# Altium schematic sheet Reflectance.SchDoc
size A3; SheetNumber: 3; SheetTotal: 9
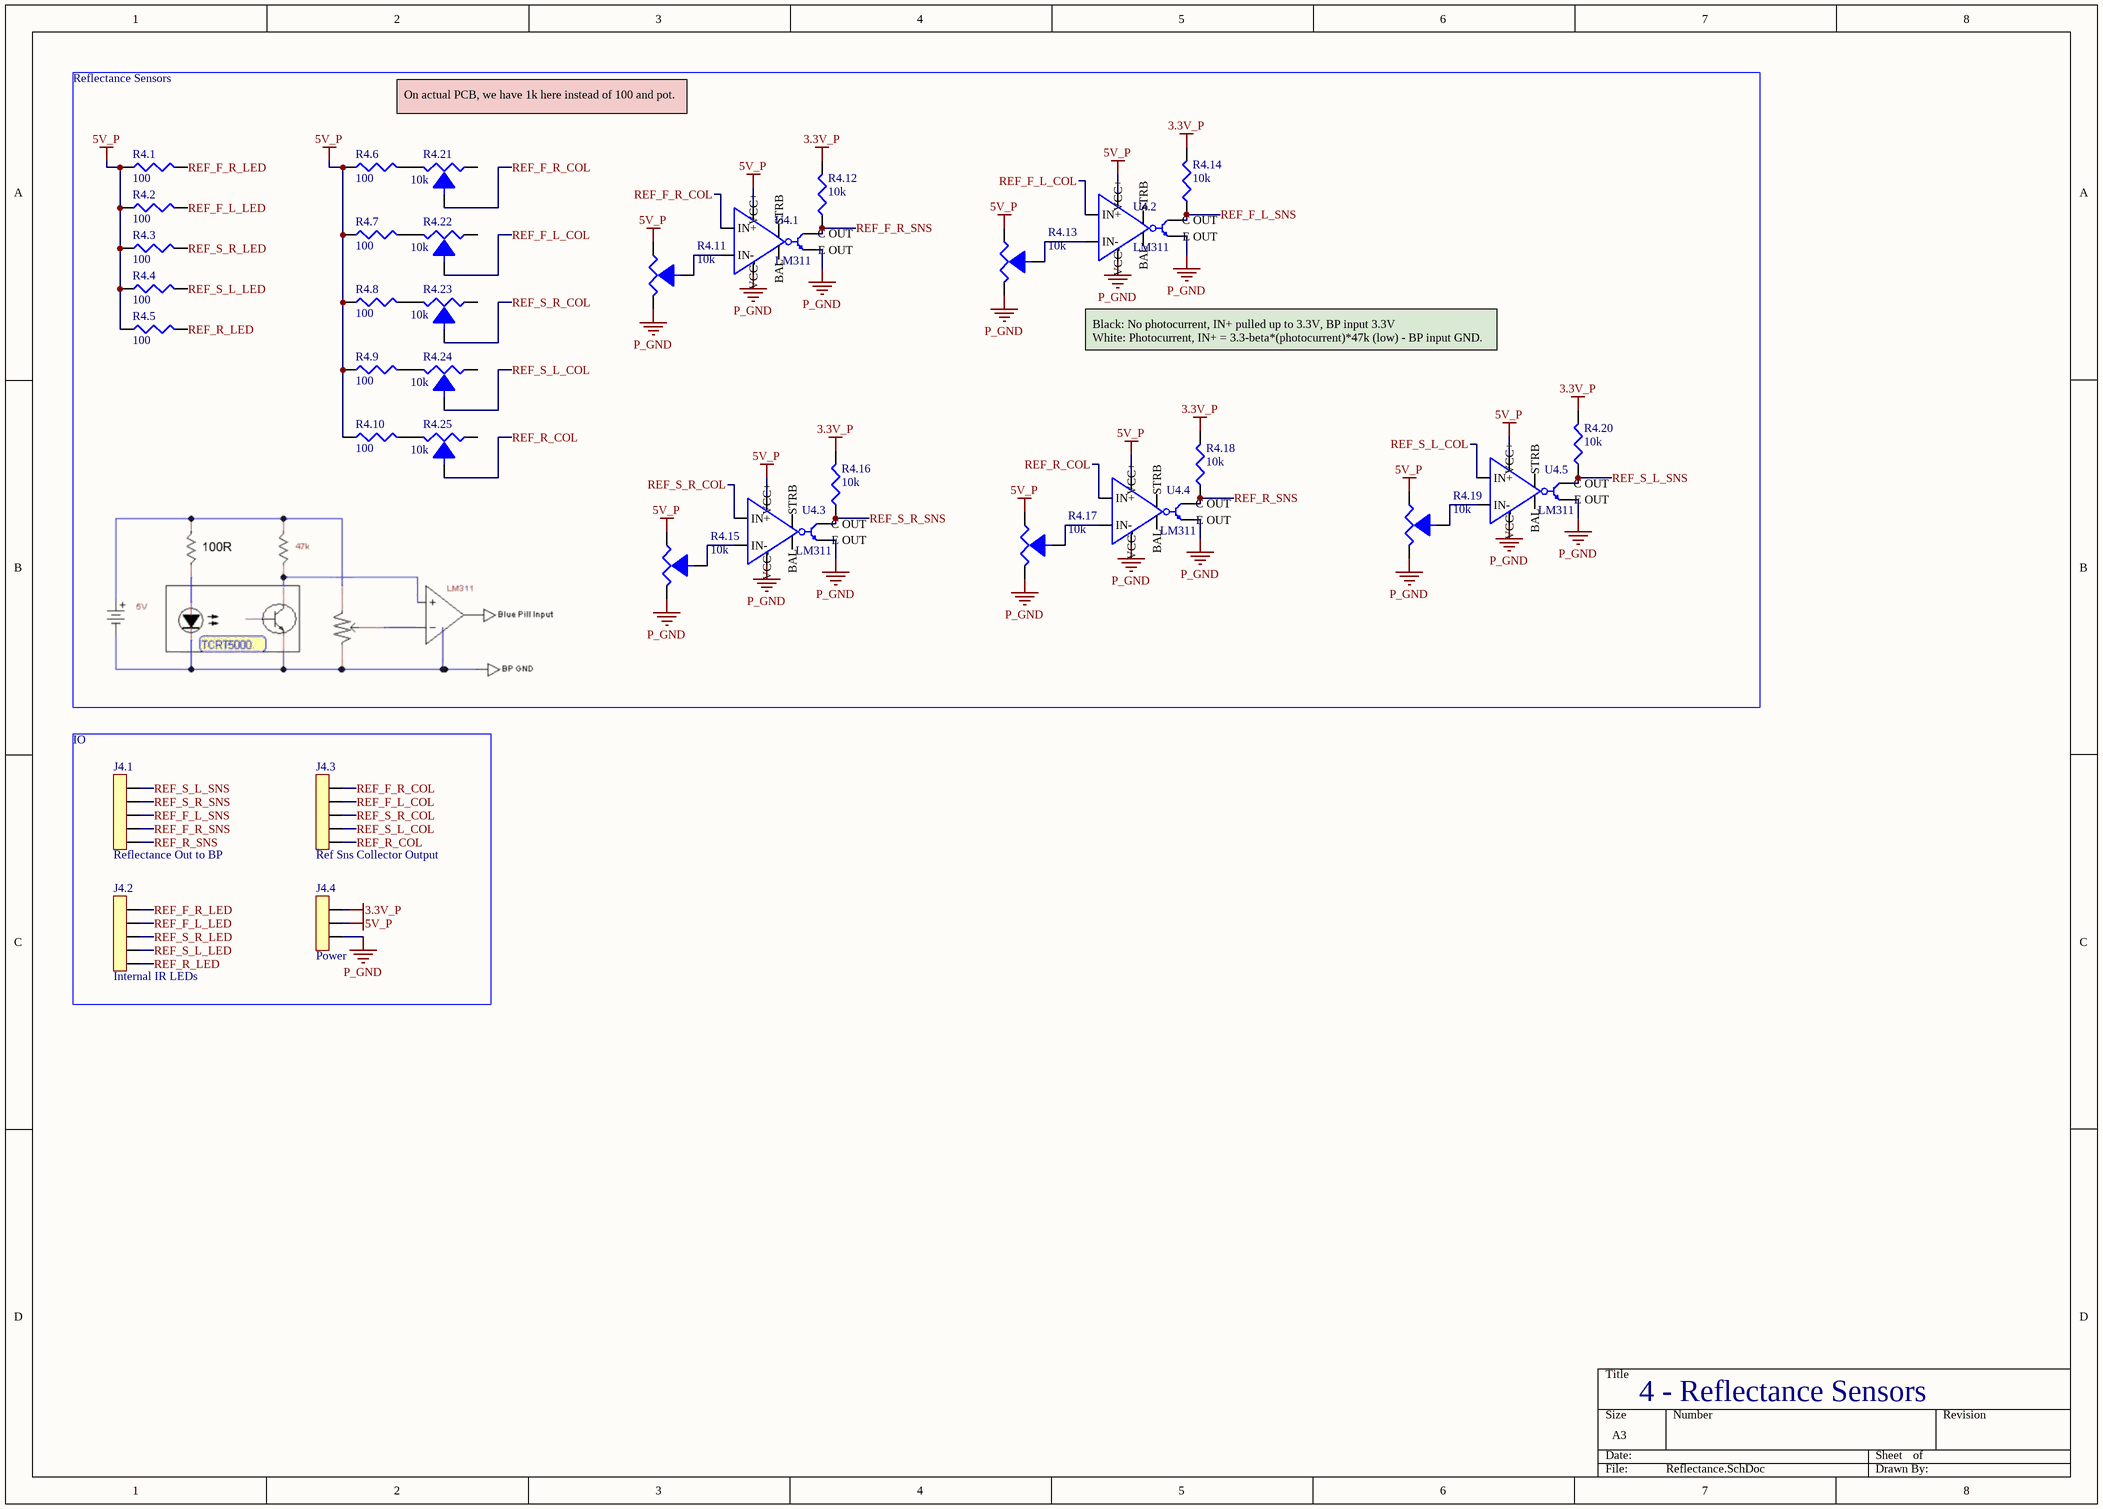
[diagram p0: Reflectance.SchDoc]

## Parts
J4.1  Reflectance Out to BP  [5POS JST]
J4.2  Internal IR LEDs  [5POS JST]
J4.3  Ref Sns Collector Output  [5POS JST]
J4.4  Power  [3pos JST]
R4.1  100  [Res_Generic]
R4.2  100  [Res_Generic]
R4.3  100  [Res_Generic]
R4.4  100  [Res_Generic]
R4.5  100  [Res_Generic]
R4.6  100  [Res_Generic]
R4.7  100  [Res_Generic]
R4.8  100  [Res_Generic]
R4.9  100  [Res_Generic]
R4.10  100  [Res_Generic]
R4.11  10k  [Pot Generic]
R4.12  10k  [Res_Generic]
R4.13  10k  [Pot Generic]
R4.14  10k  [Res_Generic]
R4.15  10k  [Pot Generic]
R4.16  10k  [Res_Generic]
R4.17  10k  [Pot Generic]
R4.18  10k  [Res_Generic]
R4.19  10k  [Pot Generic]
R4.20  10k  [Res_Generic]
R4.21  10k  [Pot Generic]
R4.22  10k  [Pot Generic]
R4.23  10k  [Pot Generic]
R4.24  10k  [Pot Generic]
R4.25  10k  [Pot Generic]
U4.1  LM311  [DIP8]
U4.2  LM311  [DIP8]
U4.3  LM311  [DIP8]
U4.4  LM311  [DIP8]
U4.5  LM311  [DIP8]

## Blocks framed on the sheet
Reflectance Sensors: R4.1-R4.25 U4.1-U4.5
IO: J4.1-J4.4

## Nets
3.3V_P: J4.4.3 R4.12.2 R4.14.2 R4.16.2 R4.18.2 R4.20.2
5V_P: J4.4.2 R4.1.1 R4.2.1 R4.3.1 R4.4.1 R4.5.1 R4.6.1 R4.7.1 R4.8.1 R4.9.1 R4.10.1 R4.11.3 R4.13.3 R4.15.3 R4.17.3 R4.19.3 U4.1.8(VCC+) U4.2.8(VCC+) U4.3.8(VCC+) U4.4.8(VCC+) U4.5.8(VCC+)
P_GND: J4.4.1 R4.11.1 R4.13.1 R4.15.1 R4.17.1 R4.19.1 U4.1.1(E_OUT) U4.1.4(VCC-) U4.2.1(E_OUT) U4.2.4(VCC-) U4.3.1(E_OUT) U4.3.4(VCC-) U4.4.1(E_OUT) U4.4.4(VCC-) U4.5.1(E_OUT) U4.5.4(VCC-)
REF_F_L_COL: J4.3.3 R4.22.2 U4.2.2(IN+)
REF_F_L_LED: J4.2.3 R4.2.2
REF_F_L_SNS: J4.1.2 R4.14.1 U4.2.7(C_OUT)
REF_F_R_COL: J4.3.4 R4.21.2 U4.1.2(IN+)
REF_F_R_LED: J4.2.4 R4.1.2
REF_F_R_SNS: J4.1.1 R4.12.1 U4.1.7(C_OUT)
REF_R_COL: J4.3.5 R4.25.2 U4.4.2(IN+)
REF_R_LED: J4.2.5 R4.5.2
REF_R_SNS: J4.1.5 R4.18.1 U4.4.7(C_OUT)
REF_S_L_COL: J4.3.1 R4.24.2 U4.5.2(IN+)
REF_S_L_LED: J4.2.1 R4.4.2
REF_S_L_SNS: J4.1.4 R4.20.1 U4.5.7(C_OUT)
REF_S_R_COL: J4.3.2 R4.23.2 U4.3.2(IN+)
REF_S_R_LED: J4.2.2 R4.3.2
REF_S_R_SNS: J4.1.3 R4.16.1 U4.3.7(C_OUT)
NetR4.6_2: R4.6.2 R4.21.1
NetR4.7_2: R4.7.2 R4.22.1
NetR4.8_2: R4.8.2 R4.23.1
NetR4.9_2: R4.9.2 R4.24.1
NetR4.10_2: R4.10.2 R4.25.1
NetR4.11_2: R4.11.2 U4.1.3(IN-)
NetR4.13_2: R4.13.2 U4.2.3(IN-)
NetR4.15_2: R4.15.2 U4.3.3(IN-)
NetR4.17_2: R4.17.2 U4.4.3(IN-)
NetR4.19_2: R4.19.2 U4.5.3(IN-)

Not connected (* = marked no-connect by the designer): R4.21 3; R4.22 3; R4.23 3; R4.24 3; R4.25 3; U4.1 5(BAL) 6(STRB); U4.2 5(BAL) 6(STRB); U4.3 5(BAL) 6(STRB); U4.4 5(BAL) 6(STRB); U4.5 5(BAL) 6(STRB)

## Notes on the sheet
- On actual PCB, we have 1k here instead of 100 and pot.
- Black: No photocurrent, IN+ pulled up to 3.3V, BP input 3.3V
  White: Photocurrent, IN+ = 3.3-beta*(photocurrent)*47k (low) - BP input GND.
- 4 - Reflectance Sensors

## Library data of the parts
J4.1-J4.3 = 5pos Conn: 5pos Conn JST
J4.4 = 3pos Conn
R4.1-R4.10 R4.12 R4.14 R4.16 R4.18 R4.20 = Res_Generic
R4.11 R4.13 R4.15 R4.17 R4.19 R4.21-R4.25 = Pot_Generic
U4.1-U4.5 = LM311 Comparator: LM311 IC DIFF COMPARATOR STROBE 8-DIP; Supplier 1: Mouser; Supplier Part Number 1: 595-LM311P